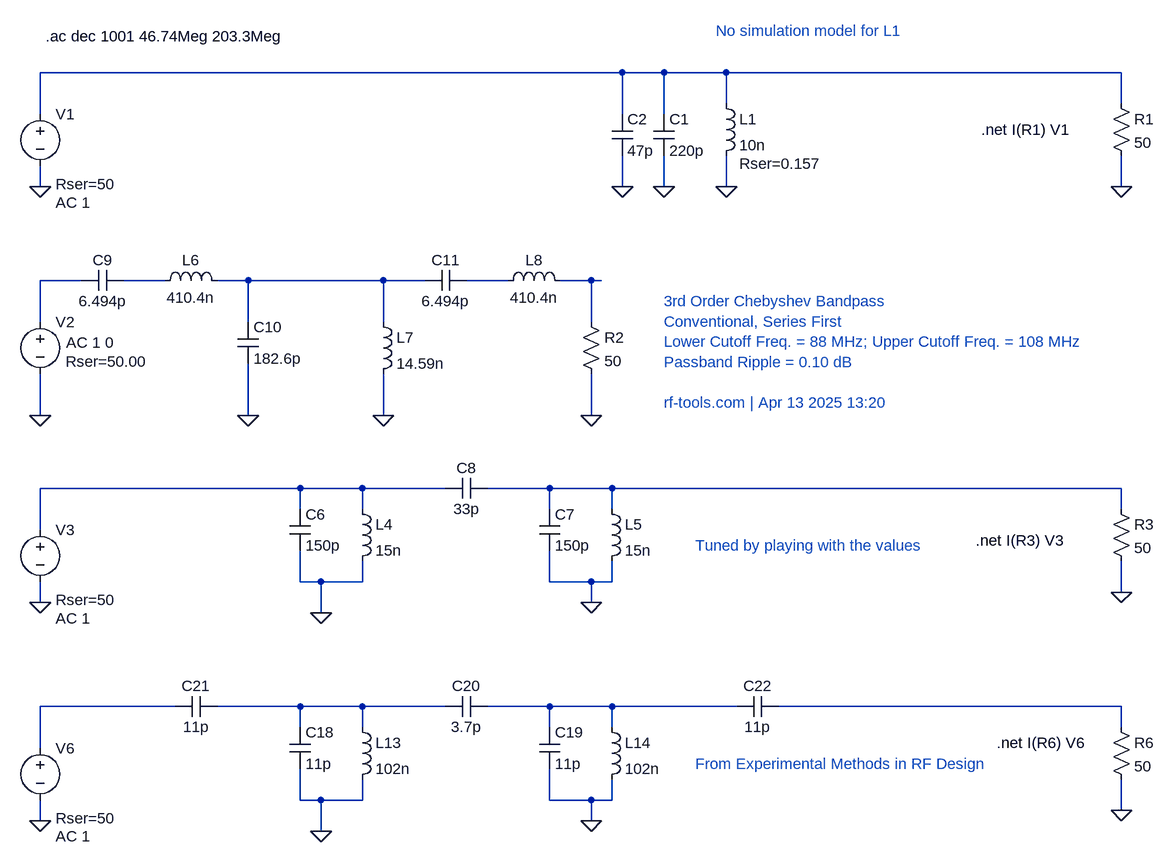
[diagram p0: schematic PreSelect_Filter.asc]
PreSelect_Filter.asc, the LTspice schematic file:
Version 4
SHEET 1 3192 1848
WIRE 128 80 -768 80
WIRE 192 80 128 80
WIRE 288 80 192 80
WIRE 896 80 288 80
WIRE 288 128 288 80
WIRE 896 128 896 80
WIRE -768 144 -768 80
WIRE 128 144 128 80
WIRE 192 144 192 80
WIRE -768 256 -768 224
WIRE 128 256 128 208
WIRE 192 256 192 208
WIRE 288 256 288 208
WIRE 896 256 896 208
WIRE -704 400 -768 400
WIRE -576 400 -640 400
WIRE -448 400 -496 400
WIRE -240 400 -448 400
WIRE -176 400 -240 400
WIRE -48 400 -112 400
WIRE 80 400 32 400
WIRE 96 400 80 400
WIRE -768 464 -768 400
WIRE -448 464 -448 400
WIRE -240 464 -240 400
WIRE 80 464 80 400
WIRE -768 608 -768 544
WIRE -448 608 -448 528
WIRE -240 608 -240 544
WIRE 80 608 80 544
WIRE -368 720 -768 720
WIRE -272 720 -368 720
WIRE -144 720 -272 720
WIRE 16 720 -80 720
WIRE 112 720 16 720
WIRE 896 720 112 720
WIRE -368 752 -368 720
WIRE -272 752 -272 720
WIRE 16 752 16 720
WIRE 112 752 112 720
WIRE 896 752 896 720
WIRE -768 784 -768 720
WIRE -368 864 -368 816
WIRE -336 864 -368 864
WIRE -272 864 -272 832
WIRE -272 864 -336 864
WIRE 16 864 16 816
WIRE 80 864 16 864
WIRE 112 864 112 832
WIRE 112 864 80 864
WIRE 896 880 896 832
WIRE -768 896 -768 864
WIRE 80 896 80 864
WIRE -336 912 -336 864
WIRE -560 1056 -768 1056
WIRE -368 1056 -496 1056
WIRE -272 1056 -368 1056
WIRE -144 1056 -272 1056
WIRE 16 1056 -80 1056
WIRE 112 1056 16 1056
WIRE 304 1056 112 1056
WIRE 896 1056 368 1056
WIRE -368 1088 -368 1056
WIRE -272 1088 -272 1056
WIRE 16 1088 16 1056
WIRE 112 1088 112 1056
WIRE 896 1088 896 1056
WIRE -768 1120 -768 1056
WIRE -368 1200 -368 1152
WIRE -336 1200 -368 1200
WIRE -272 1200 -272 1168
WIRE -272 1200 -336 1200
WIRE 16 1200 16 1152
WIRE 80 1200 16 1200
WIRE 112 1200 112 1168
WIRE 112 1200 80 1200
WIRE 896 1216 896 1168
WIRE -768 1232 -768 1200
WIRE 80 1232 80 1200
WIRE -336 1248 -336 1200
FLAG -768 256 0
FLAG 192 256 0
FLAG 288 256 0
FLAG 896 256 0
FLAG 128 256 0
FLAG -768 896 0
FLAG -336 912 0
FLAG 80 896 0
FLAG 896 880 0
FLAG -768 1232 0
FLAG -336 1248 0
FLAG 80 1232 0
FLAG 896 1216 0
FLAG -768 608 0
FLAG -448 608 0
FLAG -240 608 0
FLAG 80 608 0
SYMBOL voltage -768 128 R0
WINDOW 123 24 152 Left 2
WINDOW 39 24 124 Left 2
SYMATTR Value2 AC 1
SYMATTR SpiceLine Rser=50
SYMATTR InstName V1
SYMATTR Value ""
SYMBOL cap 176 144 R0
SYMATTR InstName C1
SYMATTR Value 220p
SYMATTR SpiceLine V=50 Irms=0 Rser=0.1207 Lser=611p mfg="Würth Elektronik" pn="885012006059 WCAP-CSGP 0603" type="NP0"
SYMBOL ind 272 112 R0
WINDOW 39 36 108 Left 2
SYMATTR SpiceLine Rser=0.157
SYMATTR InstName L1
SYMATTR Value 10n
SYMBOL res 880 112 R0
SYMATTR InstName R1
SYMATTR Value 50
SYMBOL cap 112 144 R0
SYMATTR InstName C2
SYMATTR Value 47p
SYMATTR SpiceLine V=50 Irms=0 Rser=0.2909 Lser=403p mfg="Würth Elektronik" pn="885012006055 WCAP-CSGP 0603" type="NP0"
SYMBOL voltage -768 768 R0
WINDOW 123 24 152 Left 2
WINDOW 39 24 124 Left 2
SYMATTR Value2 AC 1
SYMATTR SpiceLine Rser=50
SYMATTR InstName V3
SYMATTR Value ""
SYMBOL cap -384 752 R0
SYMATTR InstName C6
SYMATTR Value 150p
SYMBOL cap 0 752 R0
SYMATTR InstName C7
SYMATTR Value 150p
SYMBOL ind -288 736 R0
SYMATTR InstName L4
SYMATTR Value 15n
SYMBOL ind 96 736 R0
SYMATTR InstName L5
SYMATTR Value 15n
SYMBOL cap -80 704 R90
WINDOW 0 0 32 VBottom 2
WINDOW 3 32 32 VTop 2
SYMATTR InstName C8
SYMATTR Value 33p
SYMBOL res 880 736 R0
SYMATTR InstName R3
SYMATTR Value 50
SYMBOL voltage -768 1104 R0
WINDOW 123 24 152 Left 2
WINDOW 39 24 124 Left 2
SYMATTR Value2 AC 1
SYMATTR SpiceLine Rser=50
SYMATTR InstName V6
SYMATTR Value ""
SYMBOL cap -384 1088 R0
SYMATTR InstName C18
SYMATTR Value 11p
SYMBOL cap 0 1088 R0
SYMATTR InstName C19
SYMATTR Value 11p
SYMBOL ind -288 1072 R0
SYMATTR InstName L13
SYMATTR Value 102n
SYMBOL ind 96 1072 R0
SYMATTR InstName L14
SYMATTR Value 102n
SYMBOL cap -80 1040 R90
WINDOW 0 0 32 VBottom 2
WINDOW 3 32 32 VTop 2
SYMATTR InstName C20
SYMATTR Value 3.7p
SYMBOL res 880 1072 R0
SYMATTR InstName R6
SYMATTR Value 50
SYMBOL cap -496 1040 R90
WINDOW 0 0 32 VBottom 2
WINDOW 3 32 32 VTop 2
SYMATTR InstName C21
SYMATTR Value 11p
SYMBOL cap 368 1040 R90
WINDOW 0 0 32 VBottom 2
WINDOW 3 32 32 VTop 2
SYMATTR InstName C22
SYMATTR Value 11p
SYMBOL voltage -768 448 R0
WINDOW 123 40 48 Left 2
WINDOW 39 39 77 Left 2
SYMATTR Value2 AC 1 0
SYMATTR SpiceLine Rser=50.00
SYMATTR InstName V2
SYMATTR Value ""
SYMBOL cap -704 416 R270
WINDOW 0 32 32 VTop 2
WINDOW 3 0 32 VBottom 2
SYMATTR InstName C9
SYMATTR Value 6.494p
SYMBOL ind -592 416 R270
WINDOW 0 32 56 VTop 2
WINDOW 3 5 56 VBottom 2
SYMATTR InstName L6
SYMATTR Value 410.4n
SYMBOL cap -464 464 R0
SYMATTR InstName C10
SYMATTR Value 182.6p
SYMBOL ind -256 448 R0
SYMATTR InstName L7
SYMATTR Value 14.59n
SYMBOL cap -176 416 R270
WINDOW 0 32 32 VTop 2
WINDOW 3 0 32 VBottom 2
SYMATTR InstName C11
SYMATTR Value 6.494p
SYMBOL ind -64 416 R270
WINDOW 0 32 56 VTop 2
WINDOW 3 5 56 VBottom 2
SYMATTR InstName L8
SYMATTR Value 410.4n
SYMBOL res 64 448 R0
SYMATTR InstName R2
SYMATTR Value 50
TEXT 272 16 Left 2 ;No simulation model for L1
TEXT 240 808 Left 2 ;Tuned by playing with the values
TEXT 240 1144 Left 2 ;From Experimental Methods in RF Design
TEXT -760 24 Left 2 !.ac dec 1001 46.74Meg 203.3Meg
TEXT 680 168 Left 2 !.net I(R1) V1
TEXT 192 432 Left 2 ;3rd Order Chebyshev Bandpass\nConventional, Series First\nLower Cutoff Freq. = 88 MHz; Upper Cutoff Freq. = 108 MHz\nPassband Ripple = 0.10 dB\n\nrf-tools.com | Apr 13 2025 13:20
TEXT 672 800 Left 2 !.net I(R3) V3
TEXT 704 1112 Left 2 !.net I(R6) V6

The netlist it stands for:
* PreSelect_Filter.asc
V1 N001 0 AC 1 Rser=50
C1 N001 0 220p V=50 Irms=0 Rser=0.1207 Lser=611p mfg="Würth Elektronik" pn="885012006059 WCAP-CSGP 0603" type="NP0"
L1 N001 0 10n Rser=0.157
R1 N001 0 50
C2 N001 0 47p V=50 Irms=0 Rser=0.2909 Lser=403p mfg="Würth Elektronik" pn="885012006055 WCAP-CSGP 0603" type="NP0"
V3 N007 0 AC 1 Rser=50
C6 N007 0 150p
C7 N008 0 150p
L4 N007 0 15n
L5 N008 0 15n
C8 N008 N007 33p
R3 N008 0 50
V6 N009 0 AC 1 Rser=50
C18 N010 0 11p
C19 N011 0 11p
L13 N010 0 102n
L14 N011 0 102n
C20 N011 N010 3.7p
R6 N012 0 50
C21 N010 N009 11p
C22 N012 N011 11p
V2 N002 0 AC 1 0 Rser=50.00
C9 N002 N003 6.494p
L6 N003 N004 410.4n
C10 N004 0 182.6p
L7 N004 0 14.59n
C11 N004 N005 6.494p
L8 N005 N006 410.4n
R2 N006 0 50
* No simulation model for L1
* Tuned by playing with the values
* From Experimental Methods in RF Design
.ac dec 1001 46.74Meg 203.3Meg
.net I(R1) V1
* 3rd Order Chebyshev Bandpass
* Conventional, Series First
* Lower Cutoff Freq. = 88 MHz; Upper Cutoff Freq. = 108 MHz
* Passband Ripple = 0.10 dB
* rf-tools.com | Apr 13 2025 13:20
.net I(R3) V3
.net I(R6) V6
.backanno
.end